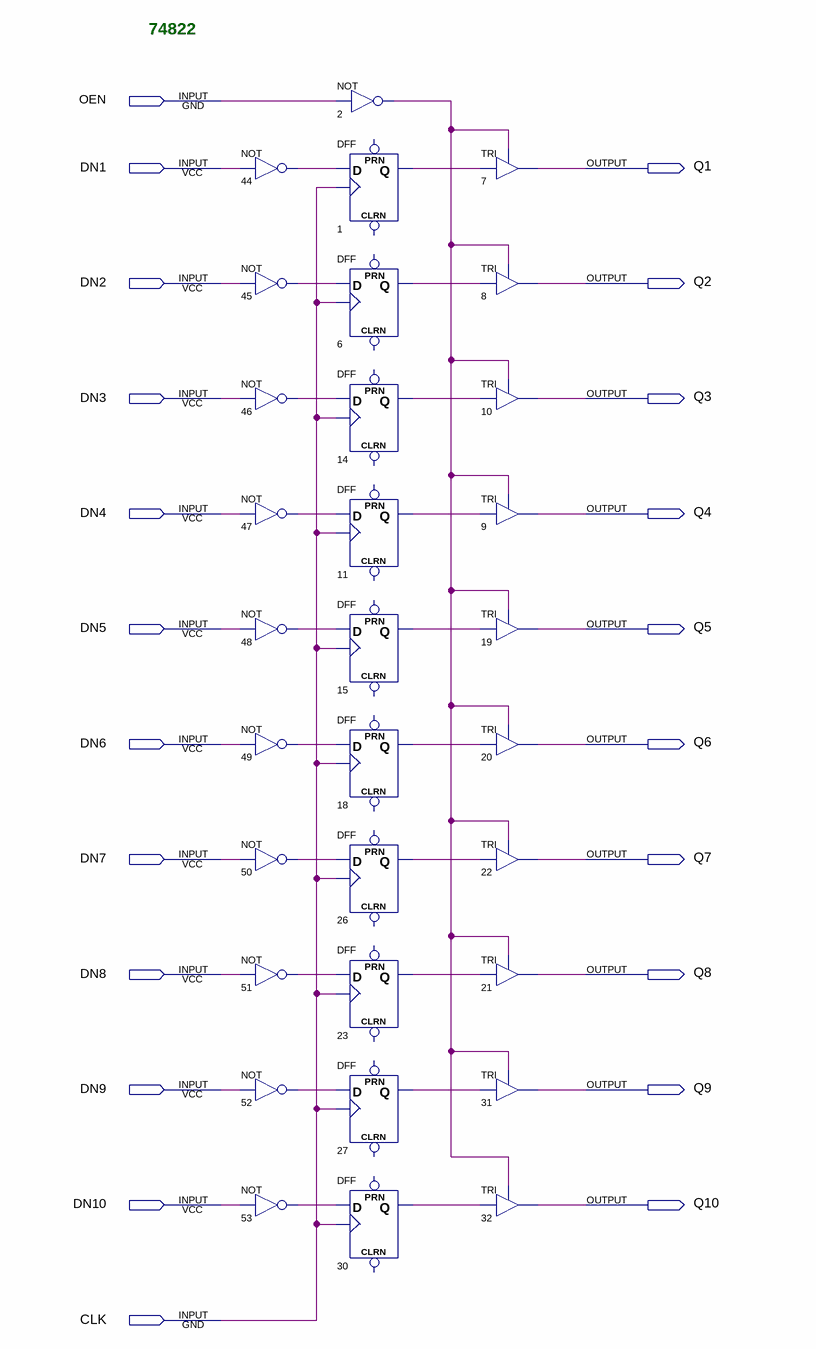
[diagram p0: schematic sheet]
// Quartus schematic 74822.bdf as structural Verilog: 31 symbols, 22 pins
module \74822  (
  input  OEN,
  input  DN1,
  input  DN2,
  input  DN3,
  input  DN4,
  input  DN5,
  input  DN6,
  input  DN7,
  input  DN8,
  input  DN9,
  input  DN10,
  input  CLK,
  output Q1,
  output Q2,
  output Q3,
  output Q4,
  output Q5,
  output Q6,
  output Q7,
  output Q8,
  output Q9,
  output Q10
);

  wire n1_q, n2_out, n6_q, n11_q, n14_q, n15_q, n18_q, n23_q, n26_q, n27_q, n30_q, n44_out, n45_out, n46_out,
       n47_out, n48_out, n49_out, n50_out, n51_out, n52_out, n53_out;

  not u_44 (n44_out, DN1);
  not u_45 (n45_out, DN2);
  not u_46 (n46_out, DN3);
  not u_47 (n47_out, DN4);
  not u_48 (n48_out, DN5);
  not u_49 (n49_out, DN6);
  not u_50 (n50_out, DN7);
  not u_51 (n51_out, DN8);
  not u_52 (n52_out, DN9);
  not u_53 (n53_out, DN10);
  not u_2 (n2_out, OEN);
  DFF u_1 (.CLK(CLK), .D(n44_out), .Q(n1_q));  // open: CLRN, PRN
  DFF u_6 (.CLK(CLK), .D(n45_out), .Q(n6_q));  // open: CLRN, PRN
  DFF u_14 (.CLK(CLK), .D(n46_out), .Q(n14_q));  // open: CLRN, PRN
  DFF u_11 (.CLK(CLK), .D(n47_out), .Q(n11_q));  // open: CLRN, PRN
  DFF u_15 (.CLK(CLK), .D(n48_out), .Q(n15_q));  // open: CLRN, PRN
  DFF u_18 (.CLK(CLK), .D(n49_out), .Q(n18_q));  // open: CLRN, PRN
  DFF u_26 (.CLK(CLK), .D(n50_out), .Q(n26_q));  // open: CLRN, PRN
  DFF u_23 (.CLK(CLK), .D(n51_out), .Q(n23_q));  // open: CLRN, PRN
  DFF u_27 (.CLK(CLK), .D(n52_out), .Q(n27_q));  // open: CLRN, PRN
  DFF u_30 (.CLK(CLK), .D(n53_out), .Q(n30_q));  // open: CLRN, PRN
  TRI u_7 (.IN(n1_q), .OE(n2_out), .OUT(Q1));
  TRI u_8 (.IN(n6_q), .OE(n2_out), .OUT(Q2));
  TRI u_10 (.IN(n14_q), .OE(n2_out), .OUT(Q3));
  TRI u_9 (.IN(n11_q), .OE(n2_out), .OUT(Q4));
  TRI u_19 (.IN(n15_q), .OE(n2_out), .OUT(Q5));
  TRI u_20 (.IN(n18_q), .OE(n2_out), .OUT(Q6));
  TRI u_22 (.IN(n26_q), .OE(n2_out), .OUT(Q7));
  TRI u_21 (.IN(n23_q), .OE(n2_out), .OUT(Q8));
  TRI u_31 (.IN(n27_q), .OE(n2_out), .OUT(Q9));
  TRI u_32 (.IN(n30_q), .OE(n2_out), .OUT(Q10));

  // Notes on the sheet:
  //   74822
endmodule
